# EAGLE design SWD-IR-V01-001 (EAGLE 7.6.0)
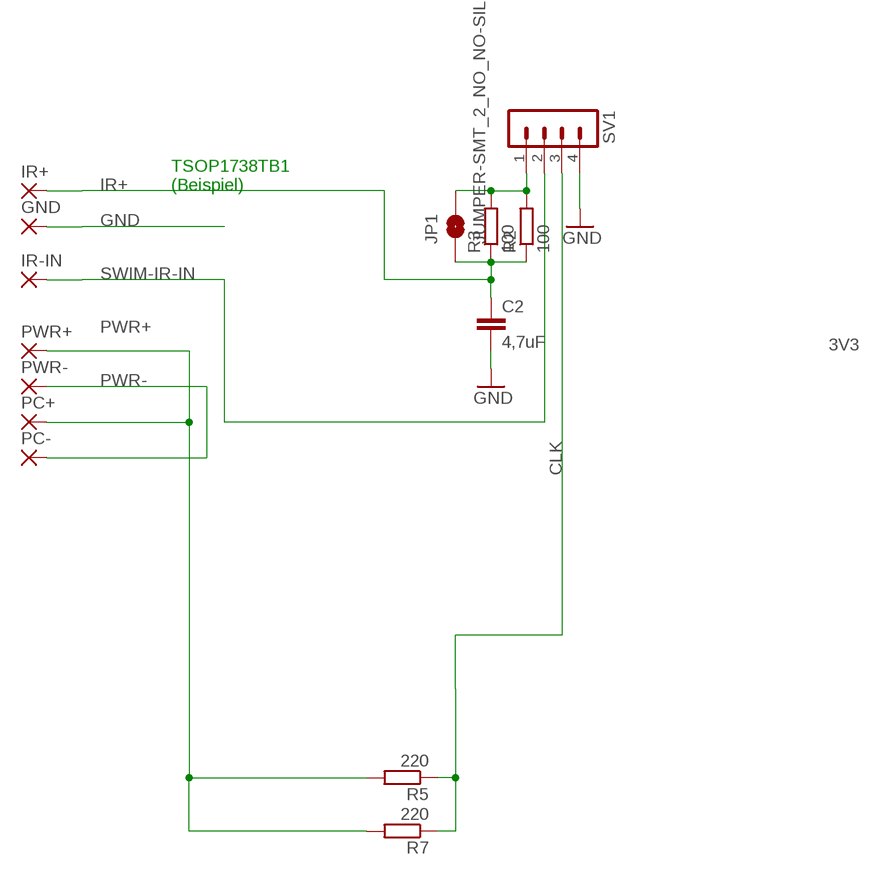
[diagram p0: schematic, sheet 1]

## Parts
C2  4,7uF  C-EUC1206K  [C1206K]
GND  SMD2  [SMD1,27-2,54]
IR+  SMD2  [SMD1,27-2,54]
IR-IN  SMD2  [SMD1,27-2,54]
JP1  JUMPER-SMT_2_NO_NO-SILK  [SMT-JUMPER_2_NO_NO-SILK]
PC+  SMD2  [SMD1,27-2,54]
PC-  SMD2  [SMD1,27-2,54]
PWR+  SMD2  [SMD1,27-2,54]
PWR-  SMD2  [SMD1,27-2,54]
R2  100  R-EU_0204/7  [0204/7]
R3  100  R-EU_R0805W  [R0805W]
R5  220  R-EU_0204/7  [0204/7]
R7  220  R-EU_R0805W  [R0805W]
SV1  MA04-1  [MA04-1]

## Nets
3V3: JP1.2 R2.2 R3.2 SV1.1
CLK: R5.1 R7.1 SV1.3
GND [Power]: C2.2 GND.1(P) SV1.4
IR+: C2.1 IR+.1(P) JP1.1 R2.1 R3.1
PWR+: PC+.1(P) PWR+.1(P) R5.2 R7.2
PWR-: PC-.1(P) PWR-.1(P)
SWIM-IR-IN: IR-IN.1(P) SV1.2

## Notes on the sheet
- TSOP1738TB1
  (Beispiel)

## Library data of the parts
C2 = rcl:C-EU: CAPACITOR, European symbol
GND IR+ IR-IN PC+ PC- PWR+ PWR- = wirepad:SMD2: SMD PAD
JP1 = SparkFun-Jumpers:JUMPER-SMT_2_NO: Normally open jumper This jumper has two pads in close proximity to each other. Apply solder to close the connection. Round pads are easier to solder for beginners, but are a lot larger. SparkFun Product that uses the round pads: SparkFun EL Sequencer <https://www.sparkfun.com/products/12781>
R2 R3 R5 R7 = rcl:R-EU_: RESISTOR, European symbol
SV1 = con-lstb:MA04-1: PIN HEADER; OC_FARNELL: unknown; OC_NEWARK: unknown

## Net classes
0 default: width 0.305 mm
1 Power: width 0.406 mm

## Board
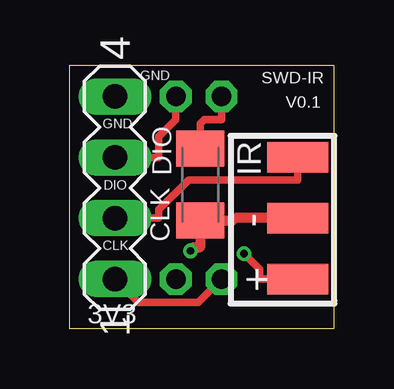
[diagram p1: board, top side]
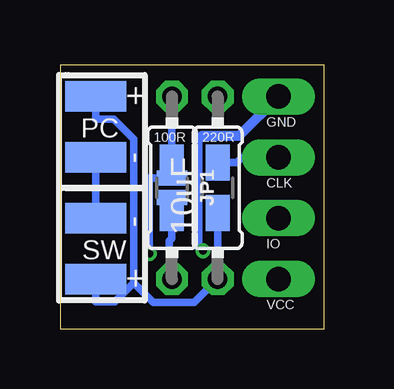
[diagram p2: board, bottom side, seen from below]

Size 11 x 11 mm. Coordinates in mm from the lower left corner, seen from the top.
Outline: 0,11 11,11 11,0 0,0 0,11
Copper layers (1*16): Top 0.035mm / dielectric 1.5mm / Bottom 0.035mm
Design rules "Fusion_eagle_rule_v1.1": minimum track width 6mil, minimum drill 12mil, track to track 6mil, track to pad 6mil, pad to pad 6mil, via to via 6mil, smd to smd 0mil, copper to edge 10mil, drill to drill 10mil, minimum pad ring 10mil, minimum via ring 6mil, stop-mask expansion 2mil, vias tented up to drill 100mil, thermal gap 10mil

### Footprints (pad centres in the part's own frame; a part is rotated, then mirrored left to right if it is on the bottom)
C1206K = smd 1.5 x 2: 1 -1.5,0; 2 1.5,0
SMD1,27-2,54 = smd 1.27 x 2.54: 1 0,0
SMT-JUMPER_2_NO_NO-SILK = smd 0.635 x 1.27: 1 -0.406,0; 2 0.406,0
0204/7 = drill 0.813 octagon: 1 -3.81,0; 2 3.81,0
R0805W = smd 1.5 x 1: 1 -1.052,0; 2 1.052,0
MA04-1 = drill 1.016 long: 1 -3.81,0; 2 -1.27,0; 3 1.27,0; 4 3.81,0

### Placement (x,y rotation side)
C2  5.45,6.02 270 top
GND  9.51,4.62 90 top
IR+  9.51,2.08 90 top
IR-IN  9.51,7.16 90 top
JP1  6.34,5.89 270 bottom
PC+  9.51,9.7 90 bottom
PC-  9.51,7.16 90 bottom
PWR+  9.51,2.08 90 bottom
PWR-  9.51,4.62 90 bottom
R2  6.34,5.89 270 bottom
R3  6.34,5.89 270 bottom
R5  4.43,5.89 270 bottom
R7  4.43,5.89 270 bottom
SV1  1.89,5.89 90 top

### Tracks (layer width: path | path; a pad name or v marks a point on that pad's centre or on a via)
3V3
  Top 0.305: SV1.1 2.86,1.11 5.37,1.11 R2.2
  Bottom 0.305: R2.2 6.45,2.2 6.45,3.67 6.34,3.78 R3.2 JP1.2
CLK
  Top 0.305: R5.1 4.43,8.73 3.72,8.02 3.72,7.16 SV1.3
  Bottom 0.305: R7.1 3.62,6.94 3.41,7.16 SV1.3
GND  (via drill 0.3 pad 0.61)
  Top 0.406: GND.1 6.9,4.62 6.8,4.52 C2.2 5.45,3.41 5.2,3.41 v5.04,3.26
  Bottom 0.406: SV1.4 3.54,8.05 5.08,8.05 5.29,7.84 5.29,3.5 v5.04,3.26
IR+  (via drill 0.3 pad 0.61)
  Top 0.305: v7.28,3.13 7.94,2.47 7.94,2.08 IR+.1 | R2.1 6.34,8.73 5.61,8.73 5.45,8.57 C2.1
  Bottom 0.305: v7.28,3.13 7.28,6.3 JP1.1 R3.1 R2.1
PWR+
  Bottom 0.305: 7.94,1.93 7.94,7.93 8.77,8.76 9.51,8.76 PC+.1 | 7.94,1.93 8.72,1.14 9.51,1.14 PWR+.1 | 7.94,1.93 7.12,1.11 5.4,1.11 R5.2 R7.2
PWR-
  Bottom 0.305: PWR-.1 PC-.1
SWIM-IR-IN
  Top 0.305: IR-IN.1 9.51,6.22 4.96,6.22 3.72,4.98 3.72,4.62 SV1.2

### Text on the board
tNames: GND | SWD-IR | V0.1 | GND | DIO | CLK | DIO | IR | - | CLK | + | 3V3
bNames: + | GND | 220R | 100R | PC | - | CLK | 10uF | - | IO | SW | + | VCC
tValues: www.neuby.de